# EAGLE schematic accelerometer (EAGLE 6.4)
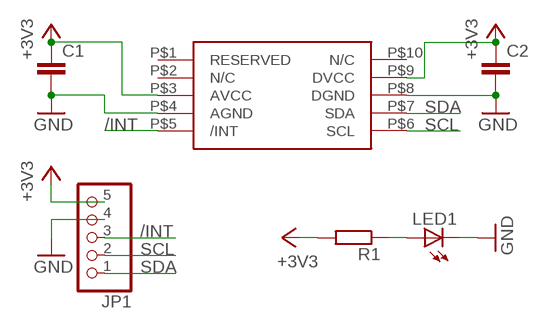
[diagram p0: schematic, sheet 1]

## Parts
C1  C-EUC0805K  [C0805K]
C2  C-EUC0805K  [C0805K]
JP1  PINHD-1X5  [1X05]
LED1  LED0805  [CHIP-LED0805]
R1  R-EU_R0805  [R0805]
U$1  MMA7660DFN-10-HAND  [DFN-10-HAND]

## Nets
+3V3: C1.1 C2.1 JP1.5 R1.2 U$1.P$3(AVCC) U$1.P$9(DVCC)
/INT: JP1.3 U$1.P$5(/INT)
GND: C1.2 C2.2 JP1.4 LED1.C U$1.P$4(AGND) U$1.P$8(DGND)
N$1: LED1.A R1.1
SCL: JP1.2 U$1.P$6(SCL)
SDA: JP1.1 U$1.P$7(SDA)
Unconnected: U$1.P$1(RESERVED) U$1.P$2(N/C) U$1.P$10(N/C)

## Library data of the parts
C1 C2 = accelerometer:C-EU: CAPACITOR, European symbol
JP1 = accelerometer:PINHD-1X5: PIN HEADER
LED1 = accelerometer:LED
R1 = accelerometer:R-EU_: RESISTOR, European symbol
U$1 = mma7660:MMA7660